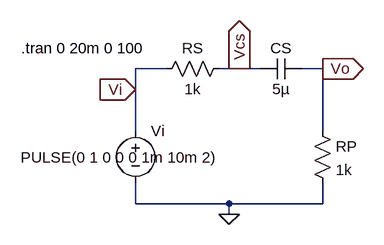
[diagram p0: schematic Medium_tau.asc]
Medium_tau.asc, the LTspice schematic file:
Version 4
SHEET 1 880 680
WIRE 144 16 96 16
WIRE 256 16 224 16
WIRE 288 16 256 16
WIRE 384 16 352 16
WIRE 96 48 96 16
WIRE 96 112 96 48
WIRE 384 112 384 16
WIRE 96 224 96 192
WIRE 240 224 96 224
WIRE 384 224 384 192
WIRE 384 224 240 224
WIRE 240 240 240 224
FLAG 240 240 0
FLAG 384 16 Vo
IOPIN 384 16 Out
FLAG 96 48 Vi
IOPIN 96 48 In
FLAG 256 16 Vcs
IOPIN 256 16 Out
SYMBOL voltage 96 96 R0
WINDOW 3 -177 57 Left 2
WINDOW 123 0 0 Left 0
WINDOW 39 0 0 Left 0
SYMATTR InstName Vi
SYMATTR Value PULSE(0 1 0 0 0 1m 10m 2)
SYMBOL res 368 96 R0
SYMATTR InstName RP
SYMATTR Value 1k
SYMBOL res 240 0 R90
WINDOW 0 0 56 VBottom 2
WINDOW 3 32 56 VTop 2
SYMATTR InstName RS
SYMATTR Value 1k
SYMBOL cap 352 0 R90
WINDOW 0 0 32 VBottom 2
WINDOW 3 32 32 VTop 2
SYMATTR InstName CS
SYMATTR Value 5µ
TEXT -80 -16 Left 2 !.tran 0 20m 0 100

The netlist it stands for:
* Medium_tau.asc
Vi Vi 0 PULSE(0 1 0 0 0 1m 10m 2)
RP Vo 0 1k
RS Vcs Vi 1k
CS Vo Vcs 5µ
.tran 0 20m 0 100
.backanno
.end